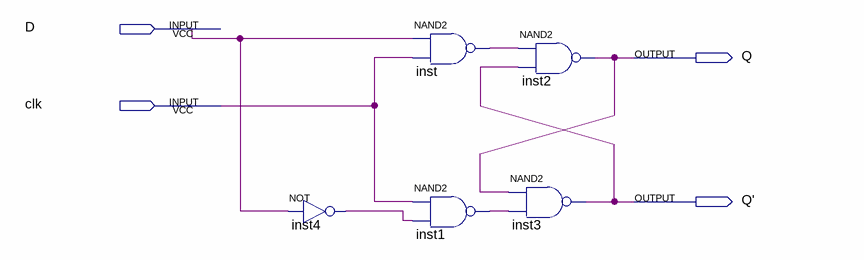
[diagram p0: schematic sheet]
// Quartus schematic dff_Q'.bdf as structural Verilog: 5 symbols, 4 pins
module \dff_Q'  (
  input  D,
  input  clk,
  output Q,
  output \Q' 
);

  wire inst1_out, inst4_out, inst_out;

  not inst4 (inst4_out, D);
  nand inst (inst_out, D, clk);
  nand inst1 (inst1_out, clk, inst4_out);
  nand inst3 (\Q' , Q, inst1_out);
  nand inst2 (Q, inst_out, \Q' );
endmodule
